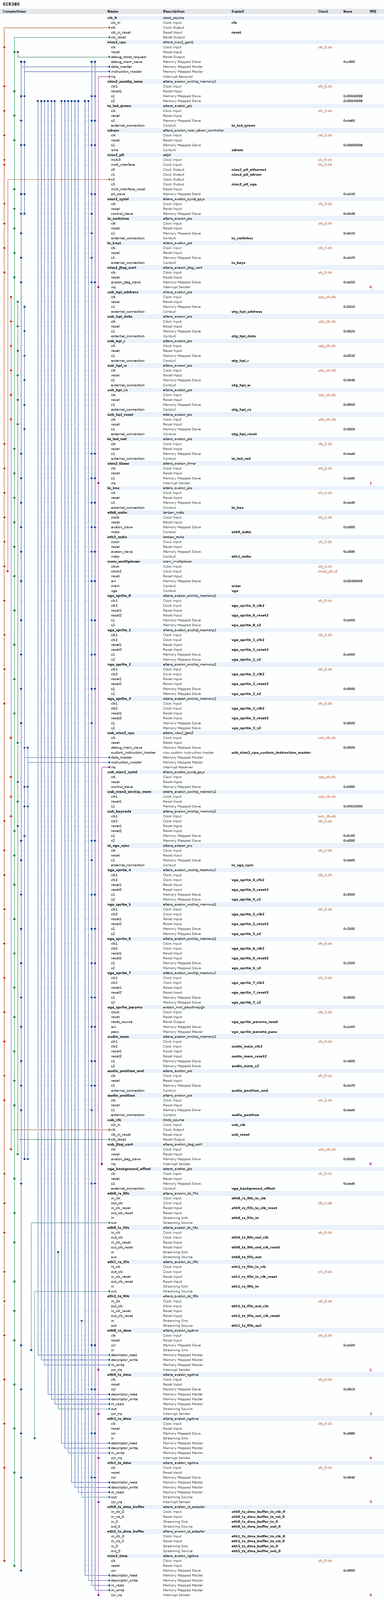
[diagram p0: system contents, whole]
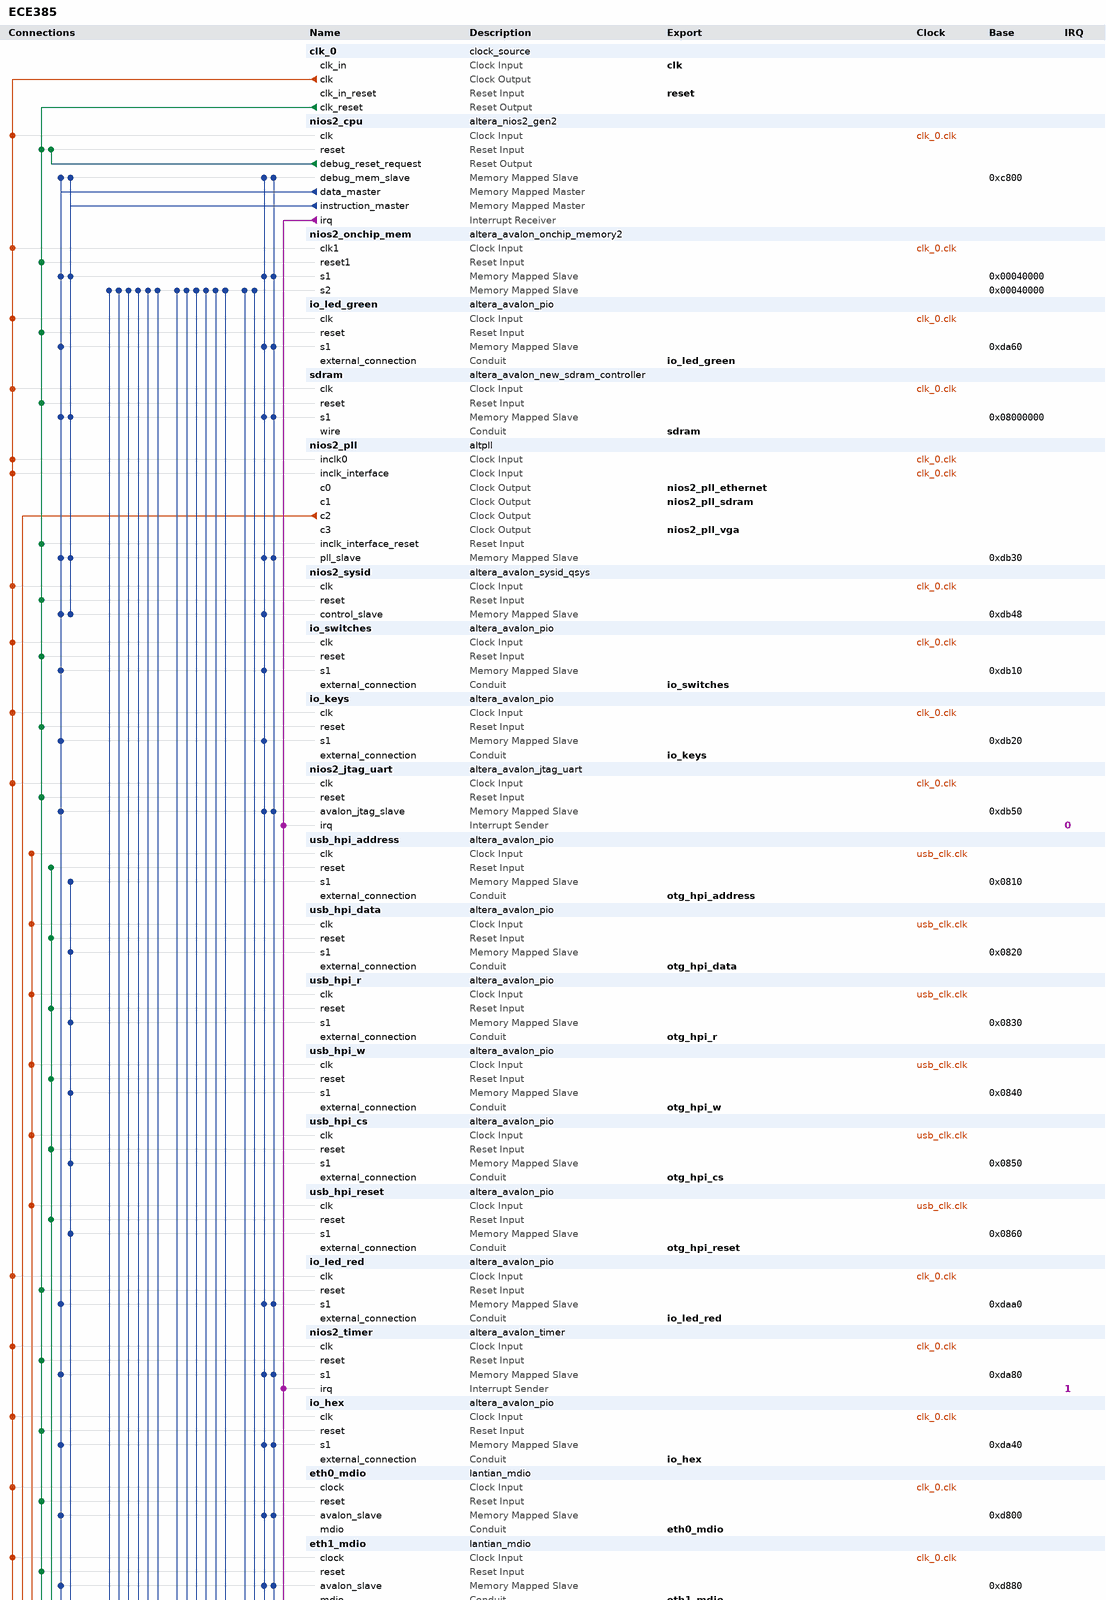
[diagram p1: system contents, upper part]
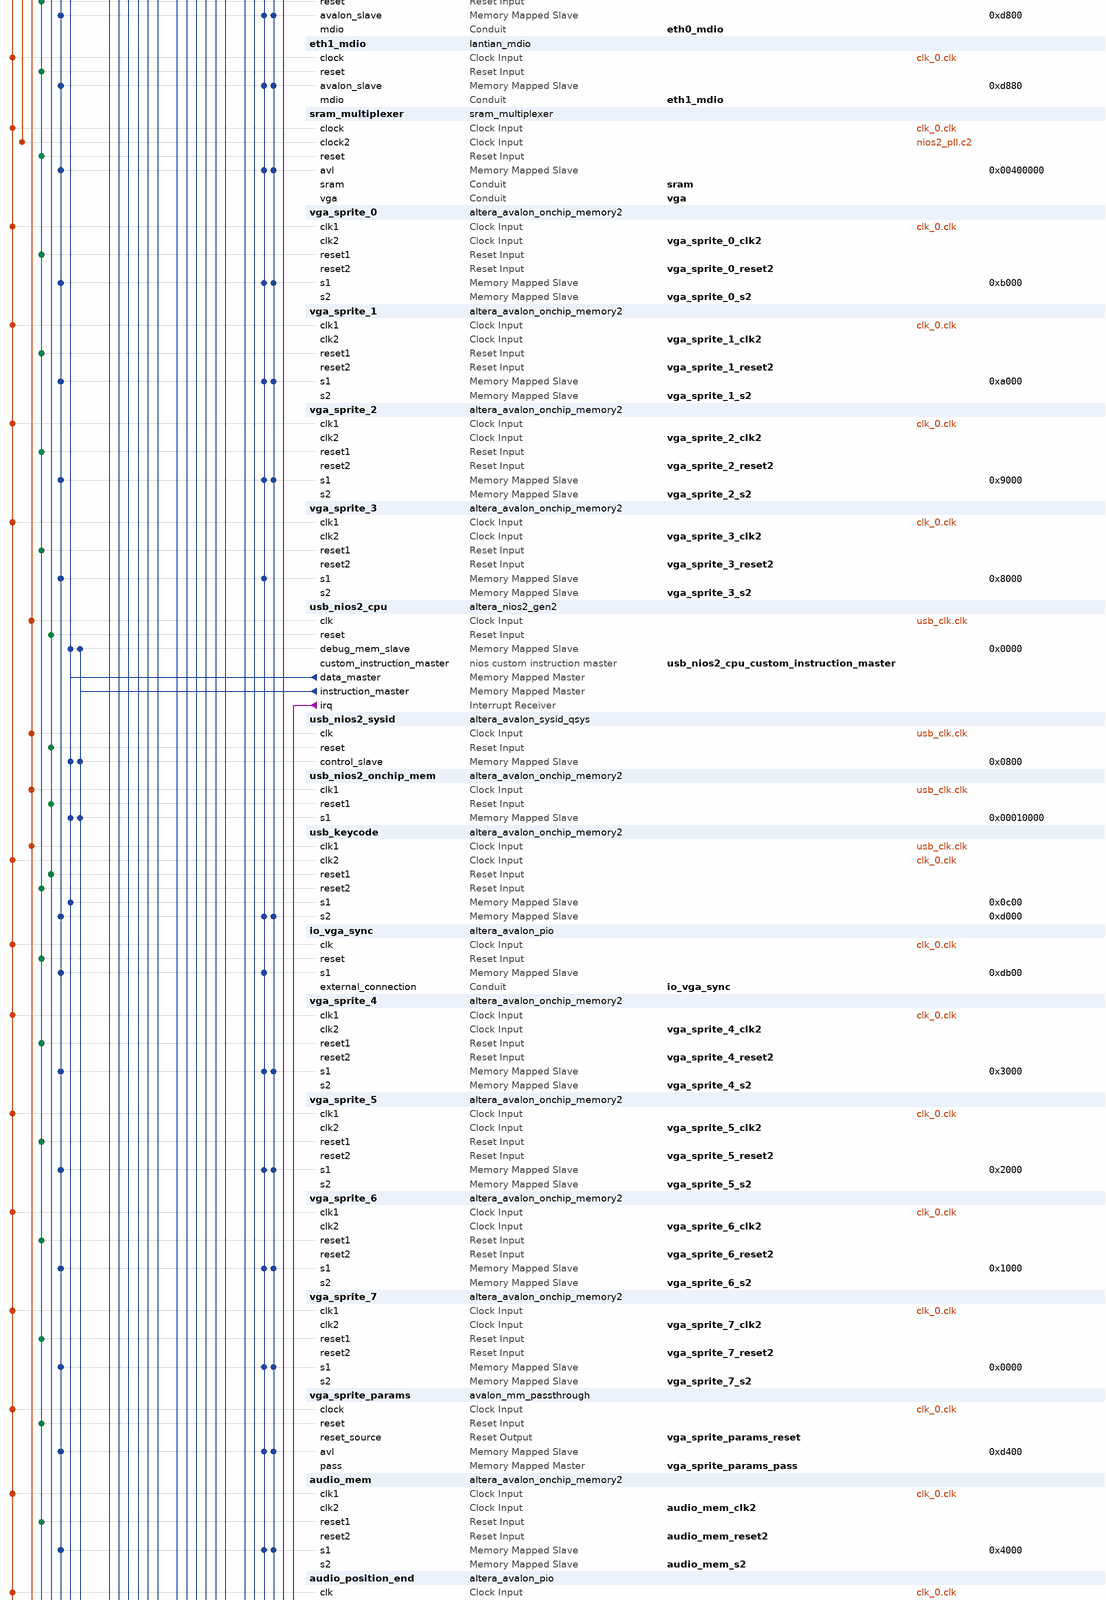
[diagram p2: system contents, middle part]
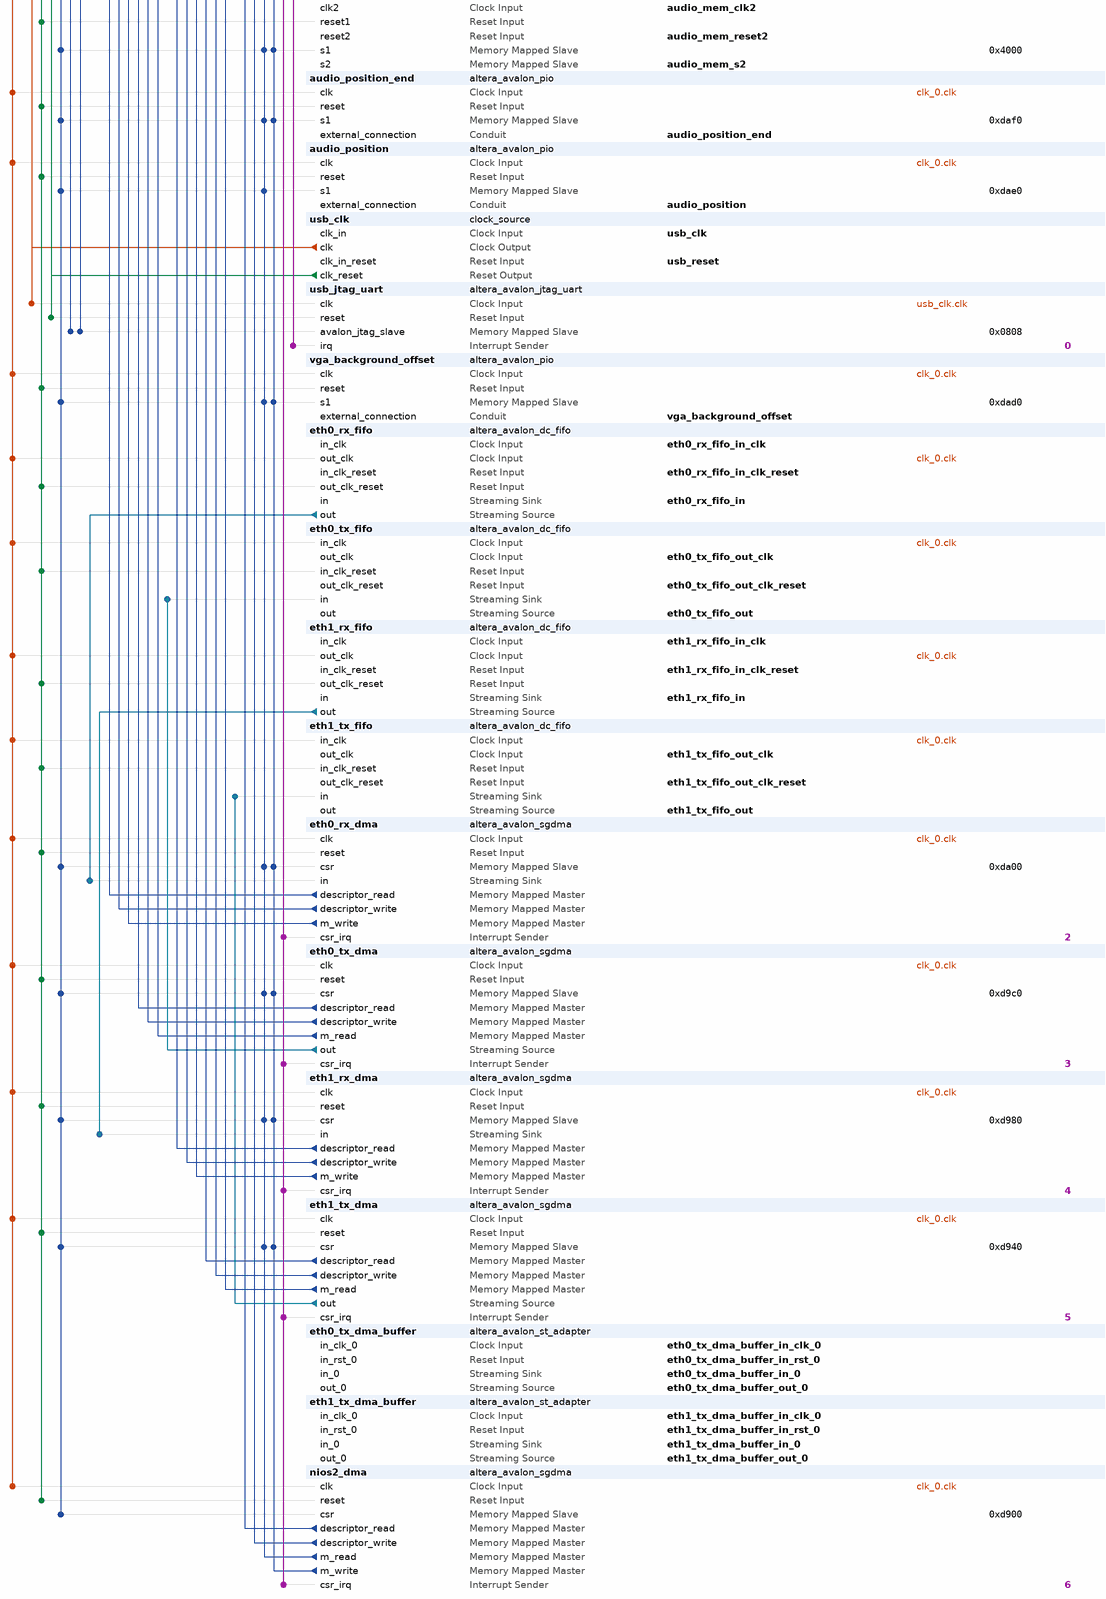
[diagram p3: system contents, lower part]
# Platform Designer (Qsys) system ECE385, Cyclone IV E EP4CE115F29C7
# Parameters at their usual value, and those the tool derives, are not listed.
package require -exact qsys 18.1
create_system ECE385
set_project_property DEVICE_FAMILY {Cyclone IV E}
set_project_property DEVICE EP4CE115F29C7

add_instance clk_0 clock_source 18.1
set_instance_parameter_value clk_0 clockFrequency 50000000

add_instance nios2_cpu altera_nios2_gen2 18.1
set_instance_parameter_value nios2_cpu dcache_size 2048
set_instance_parameter_value nios2_cpu exceptionSlave nios2_onchip_mem.s1
set_instance_parameter_value nios2_cpu icache_size 4096
set_instance_parameter_value nios2_cpu impl Tiny
set_instance_parameter_value nios2_cpu resetSlave nios2_onchip_mem.s1

add_instance nios2_onchip_mem altera_avalon_onchip_memory2 18.1
set_instance_parameter_value nios2_onchip_mem dataWidth 32
set_instance_parameter_value nios2_onchip_mem dualPort true
set_instance_parameter_value nios2_onchip_mem initMemContent true
set_instance_parameter_value nios2_onchip_mem initializationFileName onchip_mem.hex
set_instance_parameter_value nios2_onchip_mem memorySize 262144
set_instance_parameter_value nios2_onchip_mem resetrequest_enabled false
set_instance_parameter_value nios2_onchip_mem singleClockOperation true

add_instance io_led_green altera_avalon_pio 18.1
set_instance_parameter_value io_led_green bitModifyingOutReg true
set_instance_parameter_value io_led_green direction Output
set_instance_parameter_value io_led_green width 9

add_instance sdram altera_avalon_new_sdram_controller 18.1
set_instance_parameter_value sdram TAC 5.5
set_instance_parameter_value sdram TRCD 15.0
set_instance_parameter_value sdram TRFC 60.0
set_instance_parameter_value sdram TRP 15.0
set_instance_parameter_value sdram casLatency 2
set_instance_parameter_value sdram columnWidth 10
set_instance_parameter_value sdram dataWidth 32
set_instance_parameter_value sdram generateSimulationModel false
set_instance_parameter_value sdram model single_Micron_MT48LC4M32B2_7_chip
set_instance_parameter_value sdram numberOfBanks 4
set_instance_parameter_value sdram numberOfChipSelects 1
set_instance_parameter_value sdram powerUpDelay 200.0
set_instance_parameter_value sdram refreshPeriod 10.0
set_instance_parameter_value sdram rowWidth 13

add_instance nios2_pll altpll 18.1
set_instance_parameter_value nios2_pll AVALON_USE_SEPARATE_SYSCLK YES
set_instance_parameter_value nios2_pll CLK0_DIVIDE_BY 2
set_instance_parameter_value nios2_pll CLK0_MULTIPLY_BY 5
set_instance_parameter_value nios2_pll CLK1_DIVIDE_BY 1
set_instance_parameter_value nios2_pll CLK1_DUTY_CYCLE 50
set_instance_parameter_value nios2_pll CLK1_MULTIPLY_BY 1
set_instance_parameter_value nios2_pll CLK1_PHASE_SHIFT -3000
set_instance_parameter_value nios2_pll CLK2_DIVIDE_BY 1
set_instance_parameter_value nios2_pll CLK2_DUTY_CYCLE 50
set_instance_parameter_value nios2_pll CLK2_MULTIPLY_BY 2
set_instance_parameter_value nios2_pll CLK2_PHASE_SHIFT 0
set_instance_parameter_value nios2_pll CLK3_DIVIDE_BY 2
set_instance_parameter_value nios2_pll CLK3_DUTY_CYCLE 50
set_instance_parameter_value nios2_pll CLK3_MULTIPLY_BY 1
set_instance_parameter_value nios2_pll CLK3_PHASE_SHIFT 0
set_instance_parameter_value nios2_pll INCLK0_INPUT_FREQUENCY 20000
set_instance_parameter_value nios2_pll PORT_ARESET PORT_UNUSED
set_instance_parameter_value nios2_pll PORT_LOCKED PORT_UNUSED
set_instance_parameter_value nios2_pll PORT_clk1 PORT_USED
set_instance_parameter_value nios2_pll PORT_clk2 PORT_USED
set_instance_parameter_value nios2_pll PORT_clk3 PORT_USED

add_instance nios2_sysid altera_avalon_sysid_qsys 18.1
set_instance_parameter_value nios2_sysid id 0

add_instance io_switches altera_avalon_pio 18.1
set_instance_parameter_value io_switches direction Input
set_instance_parameter_value io_switches width 18

add_instance io_keys altera_avalon_pio 18.1
set_instance_parameter_value io_keys direction Input
set_instance_parameter_value io_keys width 4

add_instance nios2_jtag_uart altera_avalon_jtag_uart 18.1
set_instance_parameter_value nios2_jtag_uart simInteractiveOptions NO_INTERACTIVE_WINDOWS
set_instance_parameter_value nios2_jtag_uart useRegistersForReadBuffer true
set_instance_parameter_value nios2_jtag_uart useRegistersForWriteBuffer true

add_instance usb_hpi_address altera_avalon_pio 18.1
set_instance_parameter_value usb_hpi_address direction Output
set_instance_parameter_value usb_hpi_address width 2

add_instance usb_hpi_data altera_avalon_pio 18.1
set_instance_parameter_value usb_hpi_data direction InOut
set_instance_parameter_value usb_hpi_data width 16

add_instance usb_hpi_r altera_avalon_pio 18.1
set_instance_parameter_value usb_hpi_r direction Output
set_instance_parameter_value usb_hpi_r width 1

add_instance usb_hpi_w altera_avalon_pio 18.1
set_instance_parameter_value usb_hpi_w direction Output
set_instance_parameter_value usb_hpi_w width 1

add_instance usb_hpi_cs altera_avalon_pio 18.1
set_instance_parameter_value usb_hpi_cs direction Output
set_instance_parameter_value usb_hpi_cs width 1

add_instance usb_hpi_reset altera_avalon_pio 18.1
set_instance_parameter_value usb_hpi_reset direction Output
set_instance_parameter_value usb_hpi_reset width 1

add_instance io_led_red altera_avalon_pio 18.1
set_instance_parameter_value io_led_red bitModifyingOutReg true
set_instance_parameter_value io_led_red direction Output
set_instance_parameter_value io_led_red width 18

add_instance nios2_timer altera_avalon_timer 18.1
set_instance_parameter_value nios2_timer alwaysRun true
set_instance_parameter_value nios2_timer fixedPeriod true
set_instance_parameter_value nios2_timer period 1
set_instance_parameter_value nios2_timer periodUnits MSEC
set_instance_parameter_value nios2_timer snapshot false

add_instance io_hex altera_avalon_pio 18.1
set_instance_parameter_value io_hex bitModifyingOutReg true
set_instance_parameter_value io_hex direction Output
set_instance_parameter_value io_hex width 32

add_instance eth0_mdio lantian_mdio 1.0
set_instance_parameter_value eth0_mdio CLOCK_DIVIDER 20

add_instance eth1_mdio lantian_mdio 1.0
set_instance_parameter_value eth1_mdio CLOCK_DIVIDER 20

add_instance sram_multiplexer sram_multiplexer 1.0

add_instance vga_sprite_0 altera_avalon_onchip_memory2 18.1
set_instance_parameter_value vga_sprite_0 dataWidth 32
set_instance_parameter_value vga_sprite_0 dualPort true
set_instance_parameter_value vga_sprite_0 enableDiffWidth true
set_instance_parameter_value vga_sprite_0 initMemContent true
set_instance_parameter_value vga_sprite_0 initializationFileName onchip_mem.hex
set_instance_parameter_value vga_sprite_0 memorySize 4096
set_instance_parameter_value vga_sprite_0 resetrequest_enabled false

add_instance vga_sprite_1 altera_avalon_onchip_memory2 18.1
set_instance_parameter_value vga_sprite_1 dataWidth 32
set_instance_parameter_value vga_sprite_1 dualPort true
set_instance_parameter_value vga_sprite_1 enableDiffWidth true
set_instance_parameter_value vga_sprite_1 initMemContent true
set_instance_parameter_value vga_sprite_1 initializationFileName onchip_mem.hex
set_instance_parameter_value vga_sprite_1 memorySize 4096
set_instance_parameter_value vga_sprite_1 resetrequest_enabled false

add_instance vga_sprite_2 altera_avalon_onchip_memory2 18.1
set_instance_parameter_value vga_sprite_2 dataWidth 32
set_instance_parameter_value vga_sprite_2 dualPort true
set_instance_parameter_value vga_sprite_2 enableDiffWidth true
set_instance_parameter_value vga_sprite_2 initMemContent true
set_instance_parameter_value vga_sprite_2 initializationFileName onchip_mem.hex
set_instance_parameter_value vga_sprite_2 memorySize 4096
set_instance_parameter_value vga_sprite_2 resetrequest_enabled false

add_instance vga_sprite_3 altera_avalon_onchip_memory2 18.1
set_instance_parameter_value vga_sprite_3 dataWidth 32
set_instance_parameter_value vga_sprite_3 dualPort true
set_instance_parameter_value vga_sprite_3 enableDiffWidth true
set_instance_parameter_value vga_sprite_3 initMemContent true
set_instance_parameter_value vga_sprite_3 initializationFileName onchip_mem.hex
set_instance_parameter_value vga_sprite_3 memorySize 4096
set_instance_parameter_value vga_sprite_3 resetrequest_enabled false

add_instance usb_nios2_cpu altera_nios2_gen2 18.1
set_instance_parameter_value usb_nios2_cpu dcache_size 2048
set_instance_parameter_value usb_nios2_cpu exceptionSlave usb_nios2_onchip_mem.s1
set_instance_parameter_value usb_nios2_cpu icache_size 4096
set_instance_parameter_value usb_nios2_cpu impl Tiny
set_instance_parameter_value usb_nios2_cpu resetSlave usb_nios2_onchip_mem.s1

add_instance usb_nios2_sysid altera_avalon_sysid_qsys 18.1
set_instance_parameter_value usb_nios2_sysid id 0

add_instance usb_nios2_onchip_mem altera_avalon_onchip_memory2 18.1
set_instance_parameter_value usb_nios2_onchip_mem dataWidth 32
set_instance_parameter_value usb_nios2_onchip_mem dualPort false
set_instance_parameter_value usb_nios2_onchip_mem initMemContent true
set_instance_parameter_value usb_nios2_onchip_mem initializationFileName C:/Users/xuyh0/Desktop/zjui-ece385/final/ECE385_usb_src/ECE385_usb.hex
set_instance_parameter_value usb_nios2_onchip_mem memorySize 16384
set_instance_parameter_value usb_nios2_onchip_mem readDuringWriteMode OLD_DATA
set_instance_parameter_value usb_nios2_onchip_mem resetrequest_enabled false
set_instance_parameter_value usb_nios2_onchip_mem singleClockOperation true
set_instance_parameter_value usb_nios2_onchip_mem useNonDefaultInitFile true

add_instance usb_keycode altera_avalon_onchip_memory2 18.1
set_instance_parameter_value usb_keycode dataWidth 32
set_instance_parameter_value usb_keycode dualPort true
set_instance_parameter_value usb_keycode initMemContent true
set_instance_parameter_value usb_keycode initializationFileName onchip_mem.hex
set_instance_parameter_value usb_keycode memorySize 1024
set_instance_parameter_value usb_keycode readDuringWriteMode OLD_DATA
set_instance_parameter_value usb_keycode resetrequest_enabled false

add_instance io_vga_sync altera_avalon_pio 18.1
set_instance_parameter_value io_vga_sync direction Input
set_instance_parameter_value io_vga_sync width 1

add_instance vga_sprite_4 altera_avalon_onchip_memory2 18.1
set_instance_parameter_value vga_sprite_4 dataWidth 32
set_instance_parameter_value vga_sprite_4 dualPort true
set_instance_parameter_value vga_sprite_4 enableDiffWidth true
set_instance_parameter_value vga_sprite_4 initMemContent true
set_instance_parameter_value vga_sprite_4 initializationFileName onchip_mem.hex
set_instance_parameter_value vga_sprite_4 memorySize 4096
set_instance_parameter_value vga_sprite_4 resetrequest_enabled false

add_instance vga_sprite_5 altera_avalon_onchip_memory2 18.1
set_instance_parameter_value vga_sprite_5 dataWidth 32
set_instance_parameter_value vga_sprite_5 dualPort true
set_instance_parameter_value vga_sprite_5 enableDiffWidth true
set_instance_parameter_value vga_sprite_5 initMemContent true
set_instance_parameter_value vga_sprite_5 initializationFileName onchip_mem.hex
set_instance_parameter_value vga_sprite_5 memorySize 4096
set_instance_parameter_value vga_sprite_5 resetrequest_enabled false

add_instance vga_sprite_6 altera_avalon_onchip_memory2 18.1
set_instance_parameter_value vga_sprite_6 dataWidth 32
set_instance_parameter_value vga_sprite_6 dualPort true
set_instance_parameter_value vga_sprite_6 enableDiffWidth true
set_instance_parameter_value vga_sprite_6 initMemContent true
set_instance_parameter_value vga_sprite_6 initializationFileName onchip_mem.hex
set_instance_parameter_value vga_sprite_6 memorySize 4096
set_instance_parameter_value vga_sprite_6 resetrequest_enabled false

add_instance vga_sprite_7 altera_avalon_onchip_memory2 18.1
set_instance_parameter_value vga_sprite_7 dataWidth 32
set_instance_parameter_value vga_sprite_7 dualPort true
set_instance_parameter_value vga_sprite_7 enableDiffWidth true
set_instance_parameter_value vga_sprite_7 initMemContent true
set_instance_parameter_value vga_sprite_7 initializationFileName onchip_mem.hex
set_instance_parameter_value vga_sprite_7 memorySize 4096
set_instance_parameter_value vga_sprite_7 resetrequest_enabled false

add_instance vga_sprite_params avalon_mm_passthrough 1.0
set_instance_parameter_value vga_sprite_params ADDR_WIDTH 8

add_instance audio_mem altera_avalon_onchip_memory2 18.1
set_instance_parameter_value audio_mem dataWidth 32
set_instance_parameter_value audio_mem dualPort true
set_instance_parameter_value audio_mem enableDiffWidth true
set_instance_parameter_value audio_mem initMemContent true
set_instance_parameter_value audio_mem initializationFileName onchip_mem.hex
set_instance_parameter_value audio_mem memorySize 16384
set_instance_parameter_value audio_mem resetrequest_enabled false

add_instance audio_position_end altera_avalon_pio 18.1
set_instance_parameter_value audio_position_end direction Output
set_instance_parameter_value audio_position_end width 32

add_instance audio_position altera_avalon_pio 18.1
set_instance_parameter_value audio_position direction Input
set_instance_parameter_value audio_position width 32

add_instance usb_clk clock_source 18.1
set_instance_parameter_value usb_clk clockFrequency 50000000

add_instance usb_jtag_uart altera_avalon_jtag_uart 18.1
set_instance_parameter_value usb_jtag_uart simInteractiveOptions NO_INTERACTIVE_WINDOWS
set_instance_parameter_value usb_jtag_uart useRegistersForReadBuffer true
set_instance_parameter_value usb_jtag_uart useRegistersForWriteBuffer true

add_instance vga_background_offset altera_avalon_pio 18.1
set_instance_parameter_value vga_background_offset direction Output
set_instance_parameter_value vga_background_offset width 32

add_instance eth0_rx_fifo altera_avalon_dc_fifo 18.1
set_instance_parameter_value eth0_rx_fifo BITS_PER_SYMBOL 8
set_instance_parameter_value eth0_rx_fifo ERROR_WIDTH 3
set_instance_parameter_value eth0_rx_fifo FIFO_DEPTH 1024
set_instance_parameter_value eth0_rx_fifo USE_PACKETS 1

add_instance eth0_tx_fifo altera_avalon_dc_fifo 18.1
set_instance_parameter_value eth0_tx_fifo BITS_PER_SYMBOL 8
set_instance_parameter_value eth0_tx_fifo FIFO_DEPTH 1024
set_instance_parameter_value eth0_tx_fifo SYMBOLS_PER_BEAT 4
set_instance_parameter_value eth0_tx_fifo USE_PACKETS 1

add_instance eth1_rx_fifo altera_avalon_dc_fifo 18.1
set_instance_parameter_value eth1_rx_fifo BITS_PER_SYMBOL 8
set_instance_parameter_value eth1_rx_fifo ERROR_WIDTH 3
set_instance_parameter_value eth1_rx_fifo FIFO_DEPTH 1024
set_instance_parameter_value eth1_rx_fifo USE_PACKETS 1

add_instance eth1_tx_fifo altera_avalon_dc_fifo 18.1
set_instance_parameter_value eth1_tx_fifo BITS_PER_SYMBOL 8
set_instance_parameter_value eth1_tx_fifo FIFO_DEPTH 1024
set_instance_parameter_value eth1_tx_fifo SYMBOLS_PER_BEAT 4
set_instance_parameter_value eth1_tx_fifo USE_PACKETS 1

add_instance eth0_rx_dma altera_avalon_sgdma 18.1
set_instance_parameter_value eth0_rx_dma enableBurstTransfers false
set_instance_parameter_value eth0_rx_dma enableUnalignedTransfers false
set_instance_parameter_value eth0_rx_dma readBlockDataWidth 8
set_instance_parameter_value eth0_rx_dma sinkErrorWidth 3
set_instance_parameter_value eth0_rx_dma sourceErrorWidth 3
set_instance_parameter_value eth0_rx_dma transferMode STREAM_TO_MEMORY
set_instance_parameter_value eth0_rx_dma writeBurstcountWidth 4

add_instance eth0_tx_dma altera_avalon_sgdma 18.1
set_instance_parameter_value eth0_tx_dma enableBurstTransfers false
set_instance_parameter_value eth0_tx_dma enableUnalignedTransfers false
set_instance_parameter_value eth0_tx_dma readBlockDataWidth 32
set_instance_parameter_value eth0_tx_dma sinkErrorWidth 0
set_instance_parameter_value eth0_tx_dma sourceErrorWidth 0
set_instance_parameter_value eth0_tx_dma transferMode MEMORY_TO_STREAM
set_instance_parameter_value eth0_tx_dma writeBurstcountWidth 4

add_instance eth1_rx_dma altera_avalon_sgdma 18.1
set_instance_parameter_value eth1_rx_dma enableBurstTransfers false
set_instance_parameter_value eth1_rx_dma enableUnalignedTransfers false
set_instance_parameter_value eth1_rx_dma readBlockDataWidth 8
set_instance_parameter_value eth1_rx_dma sinkErrorWidth 3
set_instance_parameter_value eth1_rx_dma sourceErrorWidth 3
set_instance_parameter_value eth1_rx_dma transferMode STREAM_TO_MEMORY
set_instance_parameter_value eth1_rx_dma writeBurstcountWidth 4

add_instance eth1_tx_dma altera_avalon_sgdma 18.1
set_instance_parameter_value eth1_tx_dma enableBurstTransfers false
set_instance_parameter_value eth1_tx_dma enableUnalignedTransfers false
set_instance_parameter_value eth1_tx_dma readBlockDataWidth 32
set_instance_parameter_value eth1_tx_dma sinkErrorWidth 3
set_instance_parameter_value eth1_tx_dma sourceErrorWidth 0
set_instance_parameter_value eth1_tx_dma transferMode MEMORY_TO_STREAM
set_instance_parameter_value eth1_tx_dma writeBurstcountWidth 4

add_instance eth0_tx_dma_buffer altera_avalon_st_adapter 18.1
set_instance_parameter_value eth0_tx_dma_buffer inBitsPerSymbol 8
set_instance_parameter_value eth0_tx_dma_buffer inChannelWidth 0
set_instance_parameter_value eth0_tx_dma_buffer inDataWidth 32
set_instance_parameter_value eth0_tx_dma_buffer inErrorWidth 0
set_instance_parameter_value eth0_tx_dma_buffer inMaxChannel 0
set_instance_parameter_value eth0_tx_dma_buffer inReadyLatency 0
set_instance_parameter_value eth0_tx_dma_buffer inUseEmptyPort 1
set_instance_parameter_value eth0_tx_dma_buffer inUsePackets 1
set_instance_parameter_value eth0_tx_dma_buffer inUseReady 1
set_instance_parameter_value eth0_tx_dma_buffer inUseValid 1
set_instance_parameter_value eth0_tx_dma_buffer outChannelWidth 0
set_instance_parameter_value eth0_tx_dma_buffer outDataWidth 8
set_instance_parameter_value eth0_tx_dma_buffer outErrorWidth 0
set_instance_parameter_value eth0_tx_dma_buffer outMaxChannel 0
set_instance_parameter_value eth0_tx_dma_buffer outReadyLatency 0
set_instance_parameter_value eth0_tx_dma_buffer outUseEmptyPort 0
set_instance_parameter_value eth0_tx_dma_buffer outUseReady 1
set_instance_parameter_value eth0_tx_dma_buffer outUseValid 1

add_instance eth1_tx_dma_buffer altera_avalon_st_adapter 18.1
set_instance_parameter_value eth1_tx_dma_buffer inBitsPerSymbol 8
set_instance_parameter_value eth1_tx_dma_buffer inChannelWidth 0
set_instance_parameter_value eth1_tx_dma_buffer inDataWidth 32
set_instance_parameter_value eth1_tx_dma_buffer inErrorWidth 0
set_instance_parameter_value eth1_tx_dma_buffer inMaxChannel 0
set_instance_parameter_value eth1_tx_dma_buffer inReadyLatency 0
set_instance_parameter_value eth1_tx_dma_buffer inUseEmptyPort 1
set_instance_parameter_value eth1_tx_dma_buffer inUsePackets 1
set_instance_parameter_value eth1_tx_dma_buffer inUseReady 1
set_instance_parameter_value eth1_tx_dma_buffer inUseValid 1
set_instance_parameter_value eth1_tx_dma_buffer outChannelWidth 0
set_instance_parameter_value eth1_tx_dma_buffer outDataWidth 8
set_instance_parameter_value eth1_tx_dma_buffer outErrorWidth 0
set_instance_parameter_value eth1_tx_dma_buffer outMaxChannel 0
set_instance_parameter_value eth1_tx_dma_buffer outReadyLatency 0
set_instance_parameter_value eth1_tx_dma_buffer outUseEmptyPort 0
set_instance_parameter_value eth1_tx_dma_buffer outUseReady 1
set_instance_parameter_value eth1_tx_dma_buffer outUseValid 1

add_instance nios2_dma altera_avalon_sgdma 18.1
set_instance_parameter_value nios2_dma enableBurstTransfers false
set_instance_parameter_value nios2_dma enableUnalignedTransfers true
set_instance_parameter_value nios2_dma readBlockDataWidth 32
set_instance_parameter_value nios2_dma sinkErrorWidth 0
set_instance_parameter_value nios2_dma sourceErrorWidth 0
set_instance_parameter_value nios2_dma transferMode MEMORY_TO_MEMORY
set_instance_parameter_value nios2_dma writeBurstcountWidth 4

# connections
add_connection clk_0.clk audio_mem.clk1 clock
add_connection clk_0.clk audio_position.clk clock
add_connection clk_0.clk audio_position_end.clk clock
add_connection clk_0.clk eth0_mdio.clock clock
add_connection clk_0.clk eth0_rx_dma.clk clock
add_connection clk_0.clk eth0_rx_fifo.out_clk clock
add_connection clk_0.clk eth0_tx_dma.clk clock
add_connection clk_0.clk eth0_tx_fifo.in_clk clock
add_connection clk_0.clk eth1_mdio.clock clock
add_connection clk_0.clk eth1_rx_dma.clk clock
add_connection clk_0.clk eth1_rx_fifo.out_clk clock
add_connection clk_0.clk eth1_tx_dma.clk clock
add_connection clk_0.clk eth1_tx_fifo.in_clk clock
add_connection clk_0.clk io_hex.clk clock
add_connection clk_0.clk io_keys.clk clock
add_connection clk_0.clk io_led_green.clk clock
add_connection clk_0.clk io_led_red.clk clock
add_connection clk_0.clk io_switches.clk clock
add_connection clk_0.clk io_vga_sync.clk clock
add_connection clk_0.clk nios2_cpu.clk clock
add_connection clk_0.clk nios2_dma.clk clock
add_connection clk_0.clk nios2_jtag_uart.clk clock
add_connection clk_0.clk nios2_onchip_mem.clk1 clock
add_connection clk_0.clk nios2_pll.inclk0 clock
add_connection clk_0.clk nios2_pll.inclk_interface clock
add_connection clk_0.clk nios2_sysid.clk clock
add_connection clk_0.clk nios2_timer.clk clock
add_connection clk_0.clk sdram.clk clock
add_connection clk_0.clk sram_multiplexer.clock clock
add_connection clk_0.clk usb_keycode.clk2 clock
add_connection clk_0.clk vga_background_offset.clk clock
add_connection clk_0.clk vga_sprite_0.clk1 clock
add_connection clk_0.clk vga_sprite_1.clk1 clock
add_connection clk_0.clk vga_sprite_2.clk1 clock
add_connection clk_0.clk vga_sprite_3.clk1 clock
add_connection clk_0.clk vga_sprite_4.clk1 clock
add_connection clk_0.clk vga_sprite_5.clk1 clock
add_connection clk_0.clk vga_sprite_6.clk1 clock
add_connection clk_0.clk vga_sprite_7.clk1 clock
add_connection clk_0.clk vga_sprite_params.clock clock
add_connection nios2_pll.c2 sram_multiplexer.clock2 clock
add_connection usb_clk.clk usb_hpi_address.clk clock
add_connection usb_clk.clk usb_hpi_cs.clk clock
add_connection usb_clk.clk usb_hpi_data.clk clock
add_connection usb_clk.clk usb_hpi_r.clk clock
add_connection usb_clk.clk usb_hpi_reset.clk clock
add_connection usb_clk.clk usb_hpi_w.clk clock
add_connection usb_clk.clk usb_jtag_uart.clk clock
add_connection usb_clk.clk usb_keycode.clk1 clock
add_connection usb_clk.clk usb_nios2_cpu.clk clock
add_connection usb_clk.clk usb_nios2_onchip_mem.clk1 clock
add_connection usb_clk.clk usb_nios2_sysid.clk clock
add_connection clk_0.clk_reset audio_mem.reset1 reset
add_connection clk_0.clk_reset audio_position.reset reset
add_connection clk_0.clk_reset audio_position_end.reset reset
add_connection clk_0.clk_reset eth0_mdio.reset reset
add_connection clk_0.clk_reset eth0_rx_dma.reset reset
add_connection clk_0.clk_reset eth0_rx_fifo.out_clk_reset reset
add_connection clk_0.clk_reset eth0_tx_dma.reset reset
add_connection clk_0.clk_reset eth0_tx_fifo.in_clk_reset reset
add_connection clk_0.clk_reset eth1_mdio.reset reset
add_connection clk_0.clk_reset eth1_rx_dma.reset reset
add_connection clk_0.clk_reset eth1_rx_fifo.out_clk_reset reset
add_connection clk_0.clk_reset eth1_tx_dma.reset reset
add_connection clk_0.clk_reset eth1_tx_fifo.in_clk_reset reset
add_connection clk_0.clk_reset io_hex.reset reset
add_connection clk_0.clk_reset io_keys.reset reset
add_connection clk_0.clk_reset io_led_green.reset reset
add_connection clk_0.clk_reset io_led_red.reset reset
add_connection clk_0.clk_reset io_switches.reset reset
add_connection clk_0.clk_reset io_vga_sync.reset reset
add_connection clk_0.clk_reset nios2_cpu.reset reset
add_connection clk_0.clk_reset nios2_dma.reset reset
add_connection clk_0.clk_reset nios2_jtag_uart.reset reset
add_connection clk_0.clk_reset nios2_onchip_mem.reset1 reset
add_connection clk_0.clk_reset nios2_pll.inclk_interface_reset reset
add_connection clk_0.clk_reset nios2_sysid.reset reset
add_connection clk_0.clk_reset nios2_timer.reset reset
add_connection clk_0.clk_reset sdram.reset reset
add_connection clk_0.clk_reset sram_multiplexer.reset reset
add_connection clk_0.clk_reset usb_keycode.reset2 reset
add_connection clk_0.clk_reset vga_background_offset.reset reset
add_connection clk_0.clk_reset vga_sprite_0.reset1 reset
add_connection clk_0.clk_reset vga_sprite_1.reset1 reset
add_connection clk_0.clk_reset vga_sprite_2.reset1 reset
add_connection clk_0.clk_reset vga_sprite_3.reset1 reset
add_connection clk_0.clk_reset vga_sprite_4.reset1 reset
add_connection clk_0.clk_reset vga_sprite_5.reset1 reset
add_connection clk_0.clk_reset vga_sprite_6.reset1 reset
add_connection clk_0.clk_reset vga_sprite_7.reset1 reset
add_connection clk_0.clk_reset vga_sprite_params.reset reset
add_connection nios2_cpu.debug_reset_request nios2_cpu.reset reset
add_connection usb_clk.clk_reset usb_hpi_address.reset reset
add_connection usb_clk.clk_reset usb_hpi_cs.reset reset
add_connection usb_clk.clk_reset usb_hpi_data.reset reset
add_connection usb_clk.clk_reset usb_hpi_r.reset reset
add_connection usb_clk.clk_reset usb_hpi_reset.reset reset
add_connection usb_clk.clk_reset usb_hpi_w.reset reset
add_connection usb_clk.clk_reset usb_jtag_uart.reset reset
add_connection usb_clk.clk_reset usb_keycode.reset1 reset
add_connection usb_clk.clk_reset usb_nios2_cpu.reset reset
add_connection usb_clk.clk_reset usb_nios2_onchip_mem.reset1 reset
add_connection usb_clk.clk_reset usb_nios2_sysid.reset reset
add_connection eth0_rx_dma.descriptor_read nios2_onchip_mem.s2 avalon
set_connection_parameter_value eth0_rx_dma.descriptor_read/nios2_onchip_mem.s2 baseAddress 0x00040000
add_connection eth0_rx_dma.descriptor_write nios2_onchip_mem.s2 avalon
set_connection_parameter_value eth0_rx_dma.descriptor_write/nios2_onchip_mem.s2 baseAddress 0x00040000
add_connection eth0_rx_dma.m_write nios2_onchip_mem.s2 avalon
set_connection_parameter_value eth0_rx_dma.m_write/nios2_onchip_mem.s2 baseAddress 0x00040000
add_connection eth0_tx_dma.descriptor_read nios2_onchip_mem.s2 avalon
set_connection_parameter_value eth0_tx_dma.descriptor_read/nios2_onchip_mem.s2 baseAddress 0x00040000
add_connection eth0_tx_dma.descriptor_write nios2_onchip_mem.s2 avalon
set_connection_parameter_value eth0_tx_dma.descriptor_write/nios2_onchip_mem.s2 baseAddress 0x00040000
add_connection eth0_tx_dma.m_read nios2_onchip_mem.s2 avalon
set_connection_parameter_value eth0_tx_dma.m_read/nios2_onchip_mem.s2 baseAddress 0x00040000
add_connection eth1_rx_dma.descriptor_read nios2_onchip_mem.s2 avalon
set_connection_parameter_value eth1_rx_dma.descriptor_read/nios2_onchip_mem.s2 baseAddress 0x00040000
add_connection eth1_rx_dma.descriptor_write nios2_onchip_mem.s2 avalon
set_connection_parameter_value eth1_rx_dma.descriptor_write/nios2_onchip_mem.s2 baseAddress 0x00040000
add_connection eth1_rx_dma.m_write nios2_onchip_mem.s2 avalon
set_connection_parameter_value eth1_rx_dma.m_write/nios2_onchip_mem.s2 baseAddress 0x00040000
add_connection eth1_tx_dma.descriptor_read nios2_onchip_mem.s2 avalon
set_connection_parameter_value eth1_tx_dma.descriptor_read/nios2_onchip_mem.s2 baseAddress 0x00040000
add_connection eth1_tx_dma.descriptor_write nios2_onchip_mem.s2 avalon
set_connection_parameter_value eth1_tx_dma.descriptor_write/nios2_onchip_mem.s2 baseAddress 0x00040000
add_connection eth1_tx_dma.m_read nios2_onchip_mem.s2 avalon
set_connection_parameter_value eth1_tx_dma.m_read/nios2_onchip_mem.s2 baseAddress 0x00040000
add_connection nios2_cpu.data_master audio_mem.s1 avalon
set_connection_parameter_value nios2_cpu.data_master/audio_mem.s1 baseAddress 0x4000
add_connection nios2_cpu.data_master audio_position.s1 avalon
set_connection_parameter_value nios2_cpu.data_master/audio_position.s1 baseAddress 0xdae0
add_connection nios2_cpu.data_master audio_position_end.s1 avalon
set_connection_parameter_value nios2_cpu.data_master/audio_position_end.s1 baseAddress 0xdaf0
add_connection nios2_cpu.data_master eth0_mdio.avalon_slave avalon
set_connection_parameter_value nios2_cpu.data_master/eth0_mdio.avalon_slave baseAddress 0xd800
add_connection nios2_cpu.data_master eth0_rx_dma.csr avalon
set_connection_parameter_value nios2_cpu.data_master/eth0_rx_dma.csr baseAddress 0xda00
add_connection nios2_cpu.data_master eth0_tx_dma.csr avalon
set_connection_parameter_value nios2_cpu.data_master/eth0_tx_dma.csr baseAddress 0xd9c0
add_connection nios2_cpu.data_master eth1_mdio.avalon_slave avalon
set_connection_parameter_value nios2_cpu.data_master/eth1_mdio.avalon_slave baseAddress 0xd880
add_connection nios2_cpu.data_master eth1_rx_dma.csr avalon
set_connection_parameter_value nios2_cpu.data_master/eth1_rx_dma.csr baseAddress 0xd980
add_connection nios2_cpu.data_master eth1_tx_dma.csr avalon
set_connection_parameter_value nios2_cpu.data_master/eth1_tx_dma.csr baseAddress 0xd940
add_connection nios2_cpu.data_master io_hex.s1 avalon
set_connection_parameter_value nios2_cpu.data_master/io_hex.s1 baseAddress 0xda40
add_connection nios2_cpu.data_master io_keys.s1 avalon
set_connection_parameter_value nios2_cpu.data_master/io_keys.s1 baseAddress 0xdb20
add_connection nios2_cpu.data_master io_led_green.s1 avalon
set_connection_parameter_value nios2_cpu.data_master/io_led_green.s1 baseAddress 0xda60
add_connection nios2_cpu.data_master io_led_red.s1 avalon
set_connection_parameter_value nios2_cpu.data_master/io_led_red.s1 baseAddress 0xdaa0
add_connection nios2_cpu.data_master io_switches.s1 avalon
set_connection_parameter_value nios2_cpu.data_master/io_switches.s1 baseAddress 0xdb10
add_connection nios2_cpu.data_master io_vga_sync.s1 avalon
set_connection_parameter_value nios2_cpu.data_master/io_vga_sync.s1 baseAddress 0xdb00
add_connection nios2_cpu.data_master nios2_cpu.debug_mem_slave avalon
set_connection_parameter_value nios2_cpu.data_master/nios2_cpu.debug_mem_slave baseAddress 0xc800
add_connection nios2_cpu.data_master nios2_dma.csr avalon
set_connection_parameter_value nios2_cpu.data_master/nios2_dma.csr baseAddress 0xd900
add_connection nios2_cpu.data_master nios2_jtag_uart.avalon_jtag_slave avalon
set_connection_parameter_value nios2_cpu.data_master/nios2_jtag_uart.avalon_jtag_slave baseAddress 0xdb50
add_connection nios2_cpu.data_master nios2_onchip_mem.s1 avalon
set_connection_parameter_value nios2_cpu.data_master/nios2_onchip_mem.s1 baseAddress 0x00040000
add_connection nios2_cpu.data_master nios2_pll.pll_slave avalon
set_connection_parameter_value nios2_cpu.data_master/nios2_pll.pll_slave baseAddress 0xdb30
add_connection nios2_cpu.data_master nios2_sysid.control_slave avalon
set_connection_parameter_value nios2_cpu.data_master/nios2_sysid.control_slave baseAddress 0xdb48
add_connection nios2_cpu.data_master nios2_timer.s1 avalon
set_connection_parameter_value nios2_cpu.data_master/nios2_timer.s1 baseAddress 0xda80
add_connection nios2_cpu.data_master sdram.s1 avalon
set_connection_parameter_value nios2_cpu.data_master/sdram.s1 baseAddress 0x08000000
add_connection nios2_cpu.data_master sram_multiplexer.avl avalon
set_connection_parameter_value nios2_cpu.data_master/sram_multiplexer.avl baseAddress 0x00400000
add_connection nios2_cpu.data_master usb_keycode.s2 avalon
set_connection_parameter_value nios2_cpu.data_master/usb_keycode.s2 baseAddress 0xd000
add_connection nios2_cpu.data_master vga_background_offset.s1 avalon
set_connection_parameter_value nios2_cpu.data_master/vga_background_offset.s1 baseAddress 0xdad0
add_connection nios2_cpu.data_master vga_sprite_0.s1 avalon
set_connection_parameter_value nios2_cpu.data_master/vga_sprite_0.s1 baseAddress 0xb000
add_connection nios2_cpu.data_master vga_sprite_1.s1 avalon
set_connection_parameter_value nios2_cpu.data_master/vga_sprite_1.s1 baseAddress 0xa000
add_connection nios2_cpu.data_master vga_sprite_2.s1 avalon
set_connection_parameter_value nios2_cpu.data_master/vga_sprite_2.s1 baseAddress 0x9000
add_connection nios2_cpu.data_master vga_sprite_3.s1 avalon
set_connection_parameter_value nios2_cpu.data_master/vga_sprite_3.s1 baseAddress 0x8000
add_connection nios2_cpu.data_master vga_sprite_4.s1 avalon
set_connection_parameter_value nios2_cpu.data_master/vga_sprite_4.s1 baseAddress 0x3000
add_connection nios2_cpu.data_master vga_sprite_5.s1 avalon
set_connection_parameter_value nios2_cpu.data_master/vga_sprite_5.s1 baseAddress 0x2000
add_connection nios2_cpu.data_master vga_sprite_6.s1 avalon
set_connection_parameter_value nios2_cpu.data_master/vga_sprite_6.s1 baseAddress 0x1000
add_connection nios2_cpu.data_master vga_sprite_7.s1 avalon
set_connection_parameter_value nios2_cpu.data_master/vga_sprite_7.s1 baseAddress 0x0000
add_connection nios2_cpu.data_master vga_sprite_params.avl avalon
set_connection_parameter_value nios2_cpu.data_master/vga_sprite_params.avl baseAddress 0xd400
add_connection nios2_cpu.instruction_master nios2_cpu.debug_mem_slave avalon
set_connection_parameter_value nios2_cpu.instruction_master/nios2_cpu.debug_mem_slave baseAddress 0xc800
add_connection nios2_cpu.instruction_master nios2_onchip_mem.s1 avalon
set_connection_parameter_value nios2_cpu.instruction_master/nios2_onchip_mem.s1 baseAddress 0x00040000
add_connection nios2_cpu.instruction_master nios2_pll.pll_slave avalon
set_connection_parameter_value nios2_cpu.instruction_master/nios2_pll.pll_slave baseAddress 0xdb30
add_connection nios2_cpu.instruction_master nios2_sysid.control_slave avalon
set_connection_parameter_value nios2_cpu.instruction_master/nios2_sysid.control_slave baseAddress 0xdb48
add_connection nios2_cpu.instruction_master sdram.s1 avalon
set_connection_parameter_value nios2_cpu.instruction_master/sdram.s1 baseAddress 0x08000000
add_connection nios2_dma.descriptor_read nios2_onchip_mem.s2 avalon
set_connection_parameter_value nios2_dma.descriptor_read/nios2_onchip_mem.s2 baseAddress 0x00040000
add_connection nios2_dma.descriptor_write nios2_onchip_mem.s2 avalon
set_connection_parameter_value nios2_dma.descriptor_write/nios2_onchip_mem.s2 baseAddress 0x00040000
add_connection nios2_dma.m_read audio_mem.s1 avalon
set_connection_parameter_value nios2_dma.m_read/audio_mem.s1 baseAddress 0x4000
add_connection nios2_dma.m_read audio_position.s1 avalon
set_connection_parameter_value nios2_dma.m_read/audio_position.s1 baseAddress 0xdae0
add_connection nios2_dma.m_read audio_position_end.s1 avalon
set_connection_parameter_value nios2_dma.m_read/audio_position_end.s1 baseAddress 0xdaf0
add_connection nios2_dma.m_read eth0_mdio.avalon_slave avalon
set_connection_parameter_value nios2_dma.m_read/eth0_mdio.avalon_slave baseAddress 0xd800
add_connection nios2_dma.m_read eth0_rx_dma.csr avalon
set_connection_parameter_value nios2_dma.m_read/eth0_rx_dma.csr baseAddress 0xda00
add_connection nios2_dma.m_read eth0_tx_dma.csr avalon
set_connection_parameter_value nios2_dma.m_read/eth0_tx_dma.csr baseAddress 0xd9c0
add_connection nios2_dma.m_read eth1_mdio.avalon_slave avalon
set_connection_parameter_value nios2_dma.m_read/eth1_mdio.avalon_slave baseAddress 0xd880
add_connection nios2_dma.m_read eth1_rx_dma.csr avalon
set_connection_parameter_value nios2_dma.m_read/eth1_rx_dma.csr baseAddress 0xd980
add_connection nios2_dma.m_read eth1_tx_dma.csr avalon
set_connection_parameter_value nios2_dma.m_read/eth1_tx_dma.csr baseAddress 0xd940
add_connection nios2_dma.m_read io_hex.s1 avalon
set_connection_parameter_value nios2_dma.m_read/io_hex.s1 baseAddress 0xda40
add_connection nios2_dma.m_read io_keys.s1 avalon
set_connection_parameter_value nios2_dma.m_read/io_keys.s1 baseAddress 0xdb20
add_connection nios2_dma.m_read io_led_green.s1 avalon
set_connection_parameter_value nios2_dma.m_read/io_led_green.s1 baseAddress 0xda60
add_connection nios2_dma.m_read io_led_red.s1 avalon
set_connection_parameter_value nios2_dma.m_read/io_led_red.s1 baseAddress 0xdaa0
add_connection nios2_dma.m_read io_switches.s1 avalon
set_connection_parameter_value nios2_dma.m_read/io_switches.s1 baseAddress 0xdb10
add_connection nios2_dma.m_read io_vga_sync.s1 avalon
set_connection_parameter_value nios2_dma.m_read/io_vga_sync.s1 baseAddress 0xdb00
add_connection nios2_dma.m_read nios2_cpu.debug_mem_slave avalon
set_connection_parameter_value nios2_dma.m_read/nios2_cpu.debug_mem_slave baseAddress 0xc800
add_connection nios2_dma.m_read nios2_jtag_uart.avalon_jtag_slave avalon
set_connection_parameter_value nios2_dma.m_read/nios2_jtag_uart.avalon_jtag_slave baseAddress 0xdb50
add_connection nios2_dma.m_read nios2_onchip_mem.s1 avalon
set_connection_parameter_value nios2_dma.m_read/nios2_onchip_mem.s1 baseAddress 0x00040000
add_connection nios2_dma.m_read nios2_pll.pll_slave avalon
set_connection_parameter_value nios2_dma.m_read/nios2_pll.pll_slave baseAddress 0xdb30
add_connection nios2_dma.m_read nios2_sysid.control_slave avalon
set_connection_parameter_value nios2_dma.m_read/nios2_sysid.control_slave baseAddress 0xdb48
add_connection nios2_dma.m_read nios2_timer.s1 avalon
set_connection_parameter_value nios2_dma.m_read/nios2_timer.s1 baseAddress 0xda80
add_connection nios2_dma.m_read sdram.s1 avalon
set_connection_parameter_value nios2_dma.m_read/sdram.s1 baseAddress 0x08000000
add_connection nios2_dma.m_read sram_multiplexer.avl avalon
set_connection_parameter_value nios2_dma.m_read/sram_multiplexer.avl baseAddress 0x00400000
add_connection nios2_dma.m_read usb_keycode.s2 avalon
set_connection_parameter_value nios2_dma.m_read/usb_keycode.s2 baseAddress 0xd000
add_connection nios2_dma.m_read vga_background_offset.s1 avalon
set_connection_parameter_value nios2_dma.m_read/vga_background_offset.s1 baseAddress 0xdad0
add_connection nios2_dma.m_read vga_sprite_0.s1 avalon
set_connection_parameter_value nios2_dma.m_read/vga_sprite_0.s1 baseAddress 0xb000
add_connection nios2_dma.m_read vga_sprite_1.s1 avalon
set_connection_parameter_value nios2_dma.m_read/vga_sprite_1.s1 baseAddress 0xa000
add_connection nios2_dma.m_read vga_sprite_2.s1 avalon
set_connection_parameter_value nios2_dma.m_read/vga_sprite_2.s1 baseAddress 0x9000
add_connection nios2_dma.m_read vga_sprite_3.s1 avalon
set_connection_parameter_value nios2_dma.m_read/vga_sprite_3.s1 baseAddress 0x8000
add_connection nios2_dma.m_read vga_sprite_4.s1 avalon
set_connection_parameter_value nios2_dma.m_read/vga_sprite_4.s1 baseAddress 0x3000
add_connection nios2_dma.m_read vga_sprite_5.s1 avalon
set_connection_parameter_value nios2_dma.m_read/vga_sprite_5.s1 baseAddress 0x2000
add_connection nios2_dma.m_read vga_sprite_6.s1 avalon
set_connection_parameter_value nios2_dma.m_read/vga_sprite_6.s1 baseAddress 0x1000
add_connection nios2_dma.m_read vga_sprite_7.s1 avalon
set_connection_parameter_value nios2_dma.m_read/vga_sprite_7.s1 baseAddress 0x0000
add_connection nios2_dma.m_read vga_sprite_params.avl avalon
set_connection_parameter_value nios2_dma.m_read/vga_sprite_params.avl baseAddress 0xd400
add_connection nios2_dma.m_write audio_mem.s1 avalon
set_connection_parameter_value nios2_dma.m_write/audio_mem.s1 baseAddress 0x4000
add_connection nios2_dma.m_write audio_position_end.s1 avalon
set_connection_parameter_value nios2_dma.m_write/audio_position_end.s1 baseAddress 0xdaf0
add_connection nios2_dma.m_write eth0_mdio.avalon_slave avalon
set_connection_parameter_value nios2_dma.m_write/eth0_mdio.avalon_slave baseAddress 0xd800
add_connection nios2_dma.m_write eth0_rx_dma.csr avalon
set_connection_parameter_value nios2_dma.m_write/eth0_rx_dma.csr baseAddress 0xda00
add_connection nios2_dma.m_write eth0_tx_dma.csr avalon
set_connection_parameter_value nios2_dma.m_write/eth0_tx_dma.csr baseAddress 0xd9c0
add_connection nios2_dma.m_write eth1_mdio.avalon_slave avalon
set_connection_parameter_value nios2_dma.m_write/eth1_mdio.avalon_slave baseAddress 0xd880
add_connection nios2_dma.m_write eth1_rx_dma.csr avalon
set_connection_parameter_value nios2_dma.m_write/eth1_rx_dma.csr baseAddress 0xd980
add_connection nios2_dma.m_write eth1_tx_dma.csr avalon
set_connection_parameter_value nios2_dma.m_write/eth1_tx_dma.csr baseAddress 0xd940
add_connection nios2_dma.m_write io_hex.s1 avalon
set_connection_parameter_value nios2_dma.m_write/io_hex.s1 baseAddress 0xda40
add_connection nios2_dma.m_write io_led_green.s1 avalon
set_connection_parameter_value nios2_dma.m_write/io_led_green.s1 baseAddress 0xda60
add_connection nios2_dma.m_write io_led_red.s1 avalon
set_connection_parameter_value nios2_dma.m_write/io_led_red.s1 baseAddress 0xdaa0
add_connection nios2_dma.m_write nios2_cpu.debug_mem_slave avalon
set_connection_parameter_value nios2_dma.m_write/nios2_cpu.debug_mem_slave baseAddress 0xc800
add_connection nios2_dma.m_write nios2_jtag_uart.avalon_jtag_slave avalon
set_connection_parameter_value nios2_dma.m_write/nios2_jtag_uart.avalon_jtag_slave baseAddress 0xdb50
add_connection nios2_dma.m_write nios2_onchip_mem.s1 avalon
set_connection_parameter_value nios2_dma.m_write/nios2_onchip_mem.s1 baseAddress 0x00040000
add_connection nios2_dma.m_write nios2_pll.pll_slave avalon
set_connection_parameter_value nios2_dma.m_write/nios2_pll.pll_slave baseAddress 0xdb30
add_connection nios2_dma.m_write nios2_timer.s1 avalon
set_connection_parameter_value nios2_dma.m_write/nios2_timer.s1 baseAddress 0xda80
add_connection nios2_dma.m_write sdram.s1 avalon
set_connection_parameter_value nios2_dma.m_write/sdram.s1 baseAddress 0x08000000
add_connection nios2_dma.m_write sram_multiplexer.avl avalon
set_connection_parameter_value nios2_dma.m_write/sram_multiplexer.avl baseAddress 0x00400000
add_connection nios2_dma.m_write usb_keycode.s2 avalon
set_connection_parameter_value nios2_dma.m_write/usb_keycode.s2 baseAddress 0xd000
add_connection nios2_dma.m_write vga_background_offset.s1 avalon
set_connection_parameter_value nios2_dma.m_write/vga_background_offset.s1 baseAddress 0xdad0
add_connection nios2_dma.m_write vga_sprite_0.s1 avalon
set_connection_parameter_value nios2_dma.m_write/vga_sprite_0.s1 baseAddress 0xb000
add_connection nios2_dma.m_write vga_sprite_1.s1 avalon
set_connection_parameter_value nios2_dma.m_write/vga_sprite_1.s1 baseAddress 0xa000
add_connection nios2_dma.m_write vga_sprite_2.s1 avalon
set_connection_parameter_value nios2_dma.m_write/vga_sprite_2.s1 baseAddress 0x9000
add_connection nios2_dma.m_write vga_sprite_4.s1 avalon
set_connection_parameter_value nios2_dma.m_write/vga_sprite_4.s1 baseAddress 0x3000
add_connection nios2_dma.m_write vga_sprite_5.s1 avalon
set_connection_parameter_value nios2_dma.m_write/vga_sprite_5.s1 baseAddress 0x2000
add_connection nios2_dma.m_write vga_sprite_6.s1 avalon
set_connection_parameter_value nios2_dma.m_write/vga_sprite_6.s1 baseAddress 0x1000
add_connection nios2_dma.m_write vga_sprite_7.s1 avalon
set_connection_parameter_value nios2_dma.m_write/vga_sprite_7.s1 baseAddress 0x0000
add_connection nios2_dma.m_write vga_sprite_params.avl avalon
set_connection_parameter_value nios2_dma.m_write/vga_sprite_params.avl baseAddress 0xd400
add_connection usb_nios2_cpu.data_master usb_hpi_address.s1 avalon
set_connection_parameter_value usb_nios2_cpu.data_master/usb_hpi_address.s1 baseAddress 0x0810
add_connection usb_nios2_cpu.data_master usb_hpi_cs.s1 avalon
set_connection_parameter_value usb_nios2_cpu.data_master/usb_hpi_cs.s1 baseAddress 0x0850
add_connection usb_nios2_cpu.data_master usb_hpi_data.s1 avalon
set_connection_parameter_value usb_nios2_cpu.data_master/usb_hpi_data.s1 baseAddress 0x0820
add_connection usb_nios2_cpu.data_master usb_hpi_r.s1 avalon
set_connection_parameter_value usb_nios2_cpu.data_master/usb_hpi_r.s1 baseAddress 0x0830
add_connection usb_nios2_cpu.data_master usb_hpi_reset.s1 avalon
set_connection_parameter_value usb_nios2_cpu.data_master/usb_hpi_reset.s1 baseAddress 0x0860
add_connection usb_nios2_cpu.data_master usb_hpi_w.s1 avalon
set_connection_parameter_value usb_nios2_cpu.data_master/usb_hpi_w.s1 baseAddress 0x0840
add_connection usb_nios2_cpu.data_master usb_jtag_uart.avalon_jtag_slave avalon
set_connection_parameter_value usb_nios2_cpu.data_master/usb_jtag_uart.avalon_jtag_slave baseAddress 0x0808
add_connection usb_nios2_cpu.data_master usb_keycode.s1 avalon
set_connection_parameter_value usb_nios2_cpu.data_master/usb_keycode.s1 baseAddress 0x0c00
add_connection usb_nios2_cpu.data_master usb_nios2_cpu.debug_mem_slave avalon
set_connection_parameter_value usb_nios2_cpu.data_master/usb_nios2_cpu.debug_mem_slave baseAddress 0x0000
add_connection usb_nios2_cpu.data_master usb_nios2_onchip_mem.s1 avalon
set_connection_parameter_value usb_nios2_cpu.data_master/usb_nios2_onchip_mem.s1 baseAddress 0x00010000
add_connection usb_nios2_cpu.data_master usb_nios2_sysid.control_slave avalon
set_connection_parameter_value usb_nios2_cpu.data_master/usb_nios2_sysid.control_slave baseAddress 0x0800
add_connection usb_nios2_cpu.instruction_master usb_jtag_uart.avalon_jtag_slave avalon
set_connection_parameter_value usb_nios2_cpu.instruction_master/usb_jtag_uart.avalon_jtag_slave baseAddress 0x0808
add_connection usb_nios2_cpu.instruction_master usb_nios2_cpu.debug_mem_slave avalon
set_connection_parameter_value usb_nios2_cpu.instruction_master/usb_nios2_cpu.debug_mem_slave baseAddress 0x0000
add_connection usb_nios2_cpu.instruction_master usb_nios2_onchip_mem.s1 avalon
set_connection_parameter_value usb_nios2_cpu.instruction_master/usb_nios2_onchip_mem.s1 baseAddress 0x00010000
add_connection usb_nios2_cpu.instruction_master usb_nios2_sysid.control_slave avalon
set_connection_parameter_value usb_nios2_cpu.instruction_master/usb_nios2_sysid.control_slave baseAddress 0x0800
add_connection eth0_rx_fifo.out eth0_rx_dma.in avalon_streaming
add_connection eth0_tx_dma.out eth0_tx_fifo.in avalon_streaming
add_connection eth1_rx_fifo.out eth1_rx_dma.in avalon_streaming
add_connection eth1_tx_dma.out eth1_tx_fifo.in avalon_streaming
add_connection nios2_cpu.irq eth0_rx_dma.csr_irq interrupt
set_connection_parameter_value nios2_cpu.irq/eth0_rx_dma.csr_irq irqNumber 2
add_connection nios2_cpu.irq eth0_tx_dma.csr_irq interrupt
set_connection_parameter_value nios2_cpu.irq/eth0_tx_dma.csr_irq irqNumber 3
add_connection nios2_cpu.irq eth1_rx_dma.csr_irq interrupt
set_connection_parameter_value nios2_cpu.irq/eth1_rx_dma.csr_irq irqNumber 4
add_connection nios2_cpu.irq eth1_tx_dma.csr_irq interrupt
set_connection_parameter_value nios2_cpu.irq/eth1_tx_dma.csr_irq irqNumber 5
add_connection nios2_cpu.irq nios2_dma.csr_irq interrupt
set_connection_parameter_value nios2_cpu.irq/nios2_dma.csr_irq irqNumber 6
add_connection nios2_cpu.irq nios2_jtag_uart.irq interrupt
set_connection_parameter_value nios2_cpu.irq/nios2_jtag_uart.irq irqNumber 0
add_connection nios2_cpu.irq nios2_timer.irq interrupt
set_connection_parameter_value nios2_cpu.irq/nios2_timer.irq irqNumber 1
add_connection usb_nios2_cpu.irq usb_jtag_uart.irq interrupt
set_connection_parameter_value usb_nios2_cpu.irq/usb_jtag_uart.irq irqNumber 0
